# Altium schematic sheet Main.SchDoc
size A4; SheetNumber: 1; SheetTotal: 7
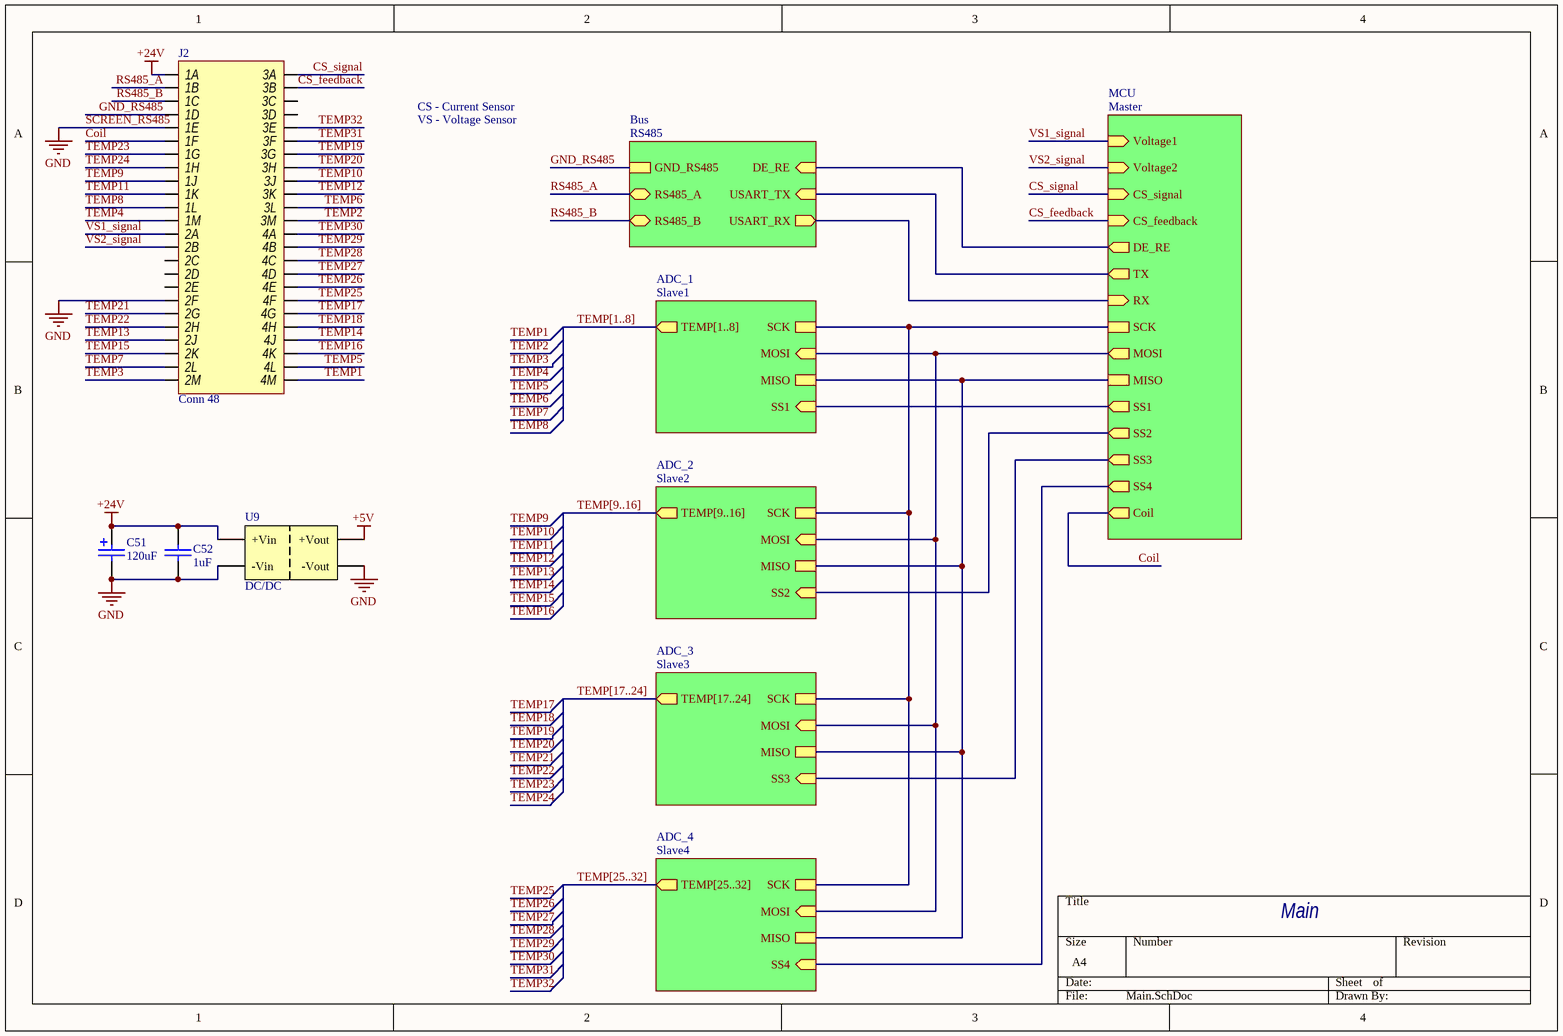
[diagram p0: Main.SchDoc]

## Parts
C51  120uF  [Bar Cap 8 mm]
C52  1uF  [0603 Capicator]
J2  Conn 48  [5007620481]
U9  DC/DC  [SIP7]

## Sub-sheets
ADC_1 = Slave1: TEMP[1..8] (out), MISO, SS1 (in), MOSI (in), SCK
ADC_2 = Slave2: TEMP[9..16] (out), MISO, SS2 (in), MOSI (in), SCK
ADC_3 = Slave3: TEMP[17..24] (out), MISO, SS3 (in), MOSI (in), SCK
ADC_4 = Slave4: TEMP[25..32] (out), MISO, SS4 (in), MOSI (in), SCK
Bus = RS485: USART_TX (in), USART_RX (out), RS485_A (bidir), RS485_B (bidir), DE_RE (in), GND_RS485
MCU = Master: MISO, SCK, SS1 (out), MOSI (out), SS2 (out), SS3 (out), SS4 (out), Coil (out), TX (out), RX (in), CS_feedback (in), CS_signal (in), DE_RE (out), Voltage2 (in), Voltage1 (in)

## Nets
+5V: U9.6(+Vout)
+24V: C51.2 C52.2 J2.1A U9.1(+Vin)
GND: C51.1 C52.1 J2.1E J2.2F U9.2(-Vin) U9.4(-Vout)
Coil: J2.1F ; sheet MCU/Coil
CS_feedback: J2.3B ; sheet MCU/CS_feedback
CS_signal: J2.3A ; sheet MCU/CS_signal
GND_RS485: J2.1D ; sheet Bus/GND_RS485
RS485_A: J2.1B ; sheet Bus/RS485_A
RS485_B: J2.1C ; sheet Bus/RS485_B
TEMP1: J2.4M
TEMP2: J2.3M
TEMP3: J2.2M
TEMP4: J2.1M
TEMP5: J2.4L
TEMP6: J2.3L
TEMP7: J2.2L
TEMP8: J2.1L
TEMP9: J2.1J
TEMP10: J2.3J
TEMP11: J2.1K
TEMP12: J2.3K
TEMP13: J2.2J
TEMP14: J2.4J
TEMP15: J2.2K
TEMP16: J2.4K
TEMP17: J2.4G
TEMP18: J2.4H
TEMP19: J2.3G
TEMP20: J2.3H
TEMP21: J2.2G
TEMP22: J2.2H
TEMP23: J2.1G
TEMP24: J2.1H
TEMP25: J2.4F
TEMP26: J2.4E
TEMP27: J2.4D
TEMP28: J2.4C
TEMP29: J2.4B
TEMP30: J2.4A
TEMP31: J2.3F
TEMP32: J2.3E
VS1_signal: J2.2A ; sheet MCU/Voltage1
VS2_signal: J2.2B ; sheet MCU/Voltage2
(unnamed): sheet MCU/MISO, sheet ADC_2/MISO, sheet ADC_1/MISO, sheet ADC_4/MISO, sheet ADC_3/MISO
(unnamed): sheet MCU/SCK, sheet ADC_2/SCK, sheet ADC_1/SCK, sheet ADC_4/SCK, sheet ADC_3/SCK
(unnamed): sheet MCU/SS1, sheet ADC_1/SS1
(unnamed): sheet MCU/MOSI, sheet ADC_2/MOSI, sheet ADC_1/MOSI, sheet ADC_4/MOSI, sheet ADC_3/MOSI
(unnamed): sheet MCU/SS2, sheet ADC_2/SS2
(unnamed): sheet MCU/SS3, sheet ADC_3/SS3
(unnamed): sheet MCU/SS4, sheet ADC_4/SS4
(unnamed): sheet MCU/TX, sheet Bus/USART_TX
(unnamed): sheet MCU/RX, sheet Bus/USART_RX
(unnamed): sheet MCU/DE_RE, sheet Bus/DE_RE

Not connected (* = marked no-connect by the designer): J2 2C 2D 2E 3C 3D

## Buses and harness runs
bus TEMP[1..8] = sheet ADC_1/TEMP[1..8]
bus TEMP[9..16] = sheet ADC_2/TEMP[9..16]
bus TEMP[17..24] = sheet ADC_3/TEMP[17..24]
bus TEMP[25..32] = sheet ADC_4/TEMP[25..32]

## Notes on the sheet
- CS - Current Sensor
- (near J2) SCREEN_RS485
- VS - Voltage Sensor
- Main

## Library data of the parts
C51 = Cap Pol 120uF: Polymer capacitor with low E.S.R. Rated voltage - 80V.; Manufacturer: Matsushita; PartNumber: EEU-FS1K121LB; Type: Capacitor; ComponentLink1Description: ChipDip; ComponentLink1URL: https://www.chipdip.ru/product0/8001968680
C52 = Cap 1uF (0603): 1uF X5R 25V 10% 0603; Manufacturer: Murata Manufacturing; Part Number: GRM188R61E105KAADD; Type: Capacitor; ComponentLink1Description: Chip&Dip; ComponentLink1URL: https://www.chipdip.ru/product/grm188r61e105k
J2 = Conn 48 (Molex): Molec 48 pin PCB Header 5007620481; Manufacturer: Molex; Type: Connector; Part Number: 5007620481; ComponentLink1Description: ChipDip; ComponentLink1URL: https://www.chipdip.ru/product0/8004298252; ComponentLink2Description: Promelec; ComponentLink2URL: https://www.promelec.ru/product/427663/; ComponentLink3Description: Datasheet; ComponentLink3URL: https://static.chipdip.ru/lib/148/DOC030148367.pdf
U9 = DC/DC Isolated 24V-5V [TMH]: The TMH series are ultra miniature, isolated 2 Watt DC/DC-converters in a Single-in-Line  package  (SIP); Manufacturer: Traco Power; Part Number: TMH2405S; ComponentLink1Description: Chip&Dip; ComponentLink1URL: https://www.chipdip.ru/product/tmh-2405s; ComponentLink2Description: DataSheet; ComponentLink2URL: https://static.chipdip.ru/lib/005/DOC001005854.pdf; Type: IC